# EAGLE design FX3 Unit Test Loopback Pod RevB (EAGLE 9.6.2)
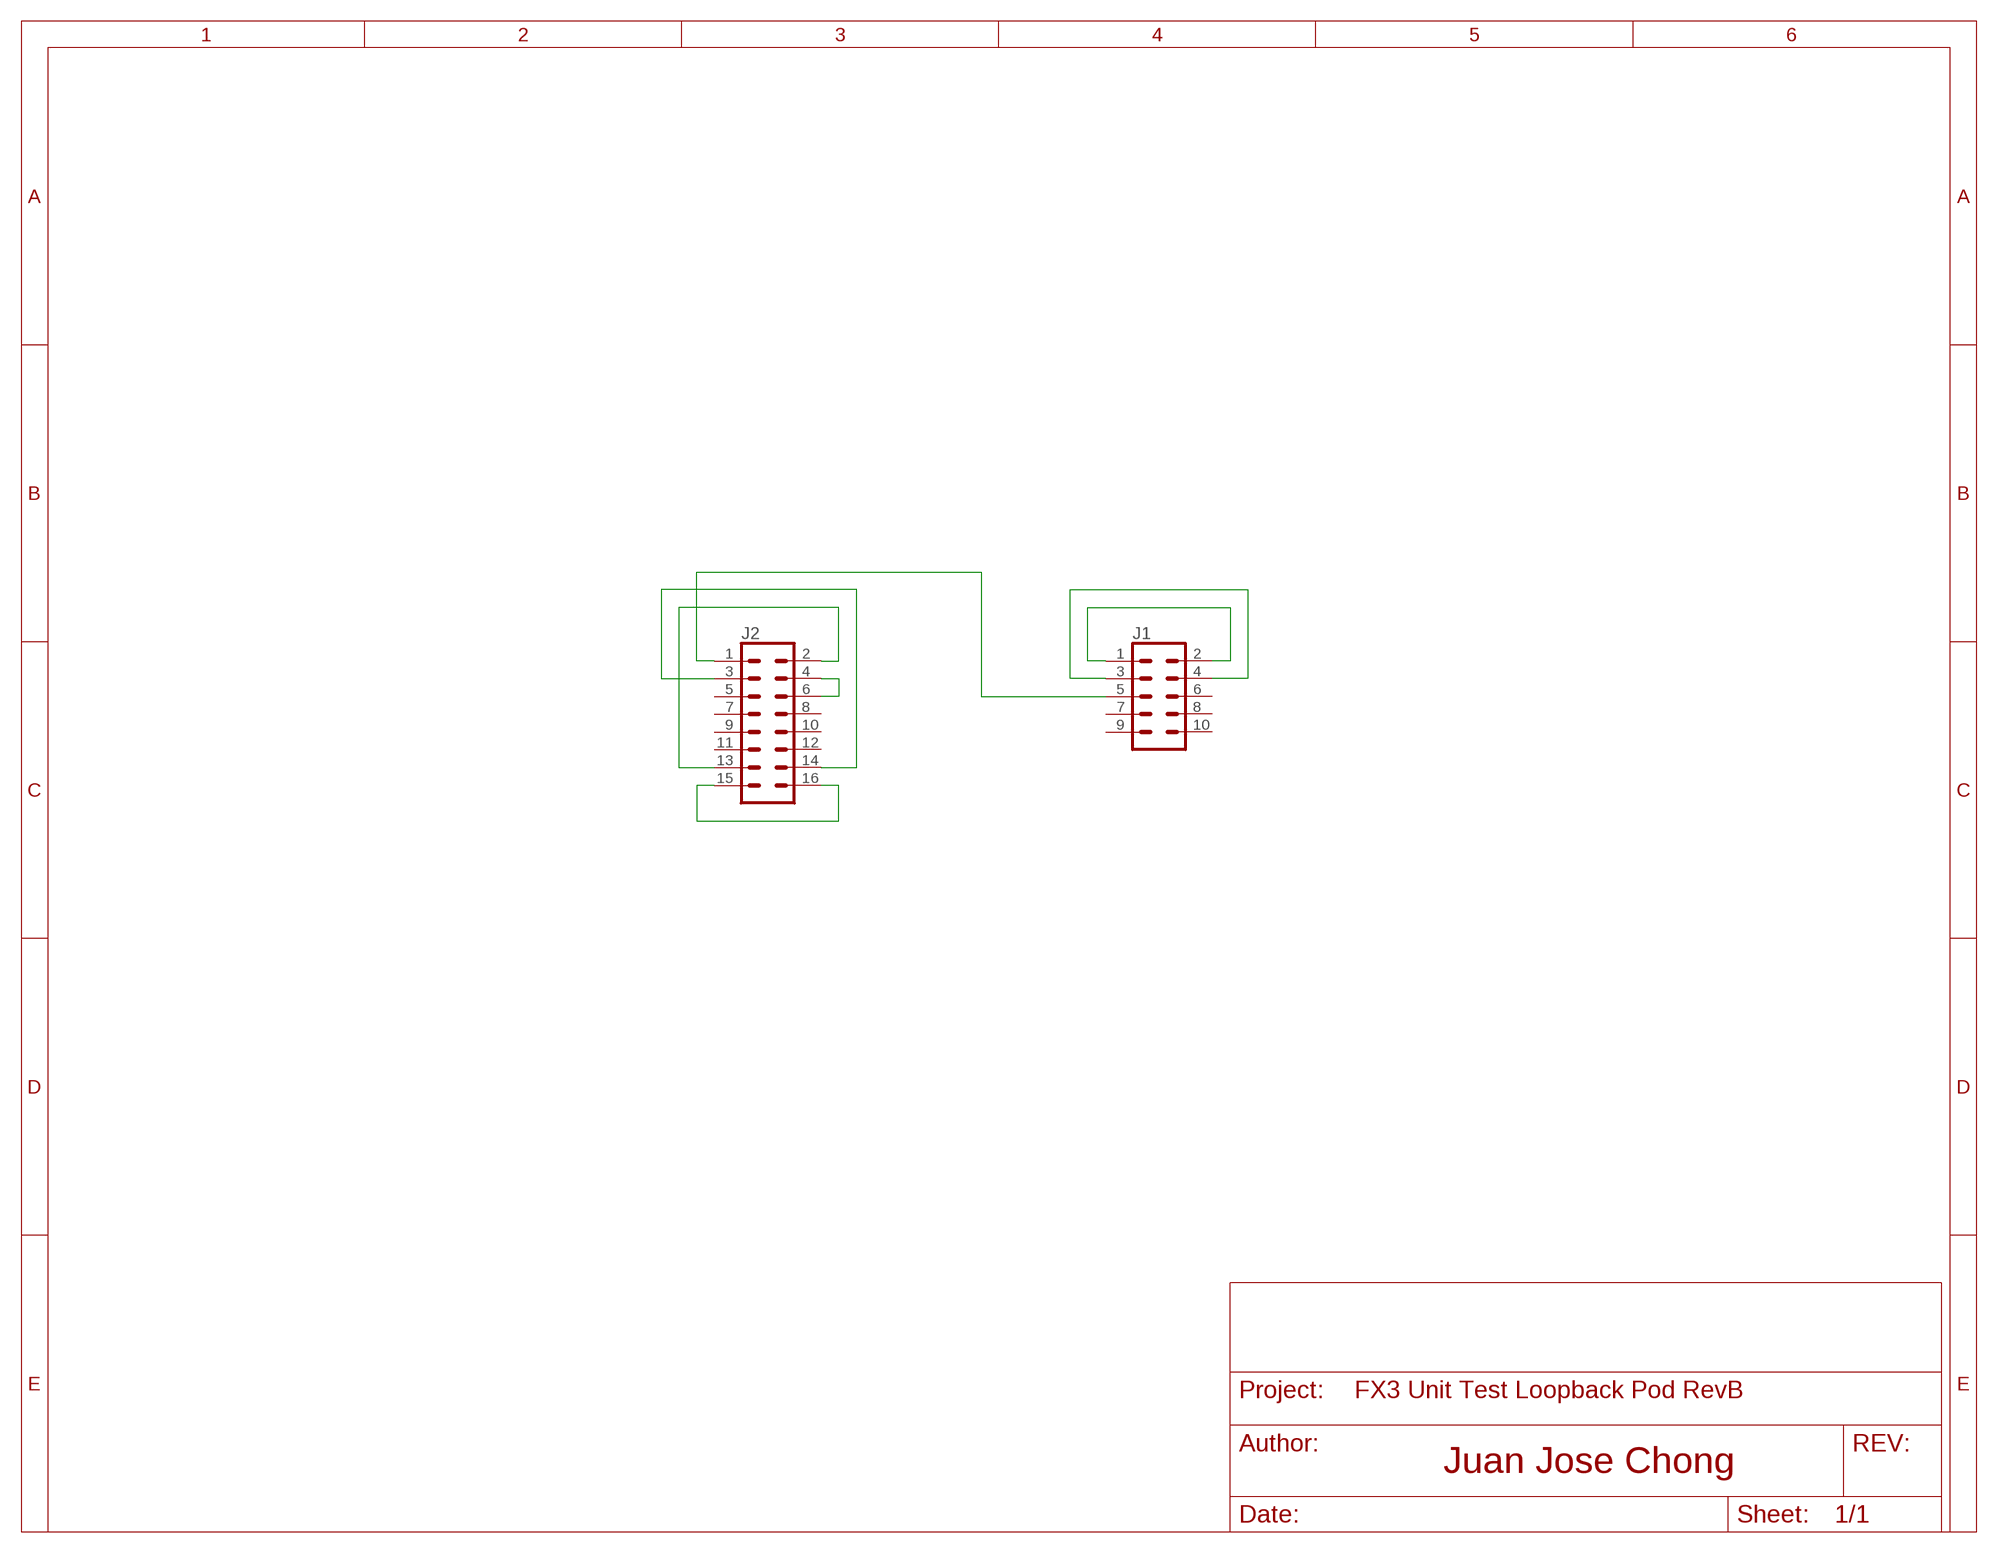
[diagram p0: schematic, sheet 1]

## Parts
J1  CONN_05X2_2MM_FEMALE  [M22-6550542R]
J2  CONN_08X2_2MM_FEMALE  [M22-6550842R]

## Nets
N$1: J2.4 J2.6
N$2: J2.2 J2.13
N$3: J2.3 J2.14
N$4: J1.1 J1.2
N$5: J2.15 J2.16
N$6: J1.3 J1.4
N$7: J1.5 J2.1
Unconnected: J1.6 J1.7 J1.8 J1.9 J1.10 J2.5 J2.7 J2.8 J2.9 J2.10 J2.11 J2.12

## Library data of the parts
J1 = ADI_iSensors_Misc:CONN_05X2: Multi connection point. Often used as Generic Header-pin footprint for 0.1 inch spaced/style header connections For AVR SPI programming port, see special device with nice symbol: "AVR_SPI_PROG_5x2.dev" You can populate with any combo of single row headers, but if you'd like an exact match, check these: 2x5 AVR ICSP Male Header <https://www.sparkfun.com/products/778> (PRT-00778) 2x5 Pin Shrouded Header <https://www.sparkfun.com/products/8506> (PRT-08506) On any of the 0.1 inch spaced packages, you can populate with these: Break Away Headers - Straight <https://www.sparkfun.com/products/116> (PRT-00116) Break Away Male Headers - Right Angle <https://www.sparkfun.com/products/553> (PRT-00553) Female Headers <https://www.sparkfun.com/products/115> (PRT-00115) Break Away Headers - Machine Pin <https://www.sparkfun.com/products/117> (PRT-00117) Break Away Female Headers - Swiss Machine Pin <https://www.sparkfun.com/products/743> (PRT-00743) Special note: the shrouded connector mates well with our 5x2 ribbon cables: 2x5 Pin IDC Ribbon Cable <https://www.sparkfun.com/products/8535> (PRT-08535)
J2 = ADI_iSensors_Misc:CONN_08X2: Multi connection point. Often used as Generic Header-pin footprint for 0.1 inch spaced/style header connections You can populate with any combo of single row headers, but if you'd like an exact match, check this: Header - 2x8 (Male, 0.1") <https://www.sparkfun.com/products/13156> (PRT-13156) On any of the 0.1 inch spaced packages, you can populate with these: Break Away Headers - Straight <https://www.sparkfun.com/products/116> (PRT-00116) Break Away Male Headers - Right Angle <https://www.sparkfun.com/products/553> (PRT-00553) Female Headers <https://www.sparkfun.com/products/115> (PRT-00115) Break Away Headers - Machine Pin <https://www.sparkfun.com/products/117> (PRT-00117) Break Away Female Headers - Swiss Machine Pin <https://www.sparkfun.com/products/743> (PRT-00743)

## Board
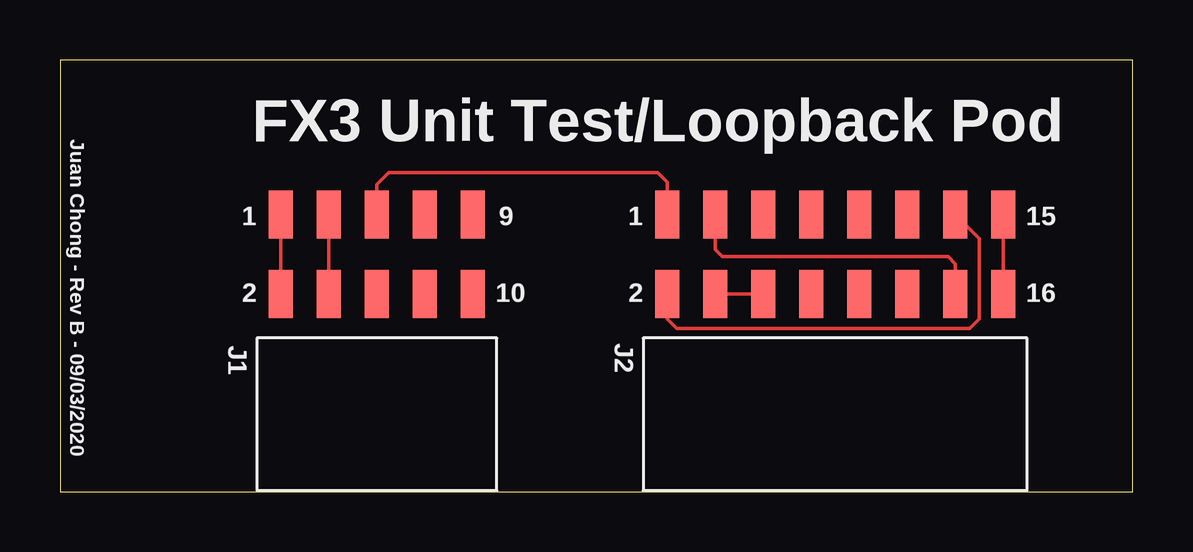
[diagram p1: board, top side]

Size 44.7 x 18 mm. Coordinates in mm from the lower left corner, seen from the top.
Outline: 0,0 44.7,0 44.7,18 0,18 0,0
Copper layers (1*16): Top 0.035mm / dielectric 1.5mm / Bottom 0.035mm
Design rules "default": minimum track width 6mil, minimum drill 0.35mm, track to track 6mil, track to pad 6mil, pad to pad 6mil, via to via 6mil, smd to smd 6mil, copper to edge 40mil, drill to drill 6mil, minimum pad ring 10mil, minimum via ring 8mil, stop-mask expansion 4mil, vias tented up to drill 0mil, thermal gap 10mil

### Footprints (pad centres in the part's own frame; a part is rotated, then mirrored left to right if it is on the bottom)
M22-6550542R = smd 1 x 2: 1 4,-1.65; 2 4,1.65; 3 2,-1.65; 4 2,1.65; 5 0,-1.65; 6 0,1.65; 7 -2,-1.65; 8 -2,1.65; 9 -4,-1.65; 10 -4,1.65
M22-6550842R = smd 1 x 2: 1 7,-1.65; 2 7,1.65; 3 5,-1.65; 4 5,1.65; 5 3,-1.65; 6 3,1.65; 7 1,-1.65; 8 1,1.65; 9 -1,-1.65; 10 -1,1.65; 11 -3,-1.65; 12 -3,1.65; 13 -5,-1.65; 14 -5,1.65; 15 -7,-1.65; 16 -7,1.65

### Placement (x,y rotation side)
J1  13.2,9.9 180 top
J2  32.3,9.9 180 top

### Tracks (layer width: path | path; a pad name or v marks a point on that pad's centre or on a via)
N$1
  Top 0.152: J2.6 J2.4
N$2
  Top 0.152: J2.2 25.3,7.2 25.7,6.8 37.9,6.8 38.3,7.2 38.3,10.55 J2.13
N$3
  Top 0.152: J2.3 27.3,10.1 27.6,9.8 37,9.8 37.3,9.5 J2.14
N$4
  Top 0.152: J1.1 J1.2
N$5
  Top 0.152: J2.15 J2.16
N$6
  Top 0.152: J1.3 J1.4
N$7
  Top 0.152: J1.5 13.2,12.8 13.7,13.3 24.9,13.3 25.3,12.9 J2.1

### Text on the board
tNames: Juan Chong - Rev B - 09/03/2020 | FX3 Unit Test/Loopback Pod